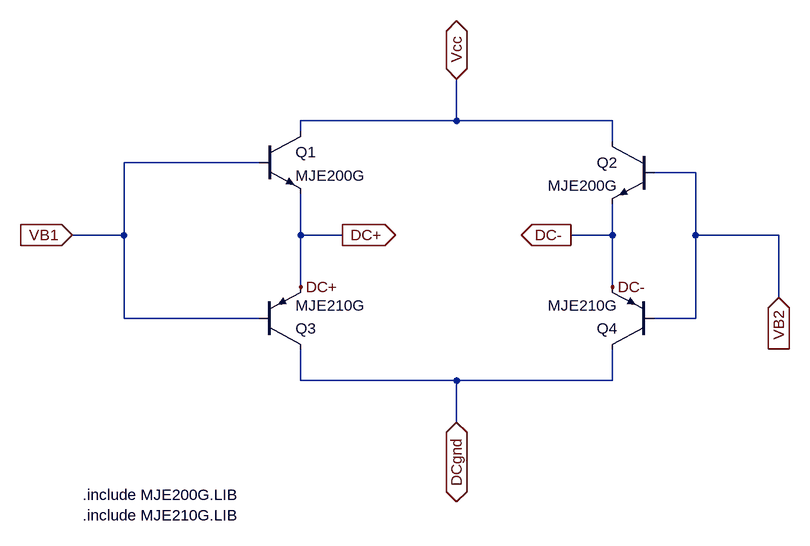
[diagram p0: schematic DC_Motor_Driver.asc]
DC_Motor_Driver.asc, the LTspice schematic file:
Version 4
SHEET 1 1376 684
WIRE 416 32 416 -32
WIRE 416 32 176 32
WIRE 656 32 416 32
WIRE 176 48 176 32
WIRE 656 64 656 32
WIRE 112 96 -96 96
WIRE 784 112 720 112
WIRE -96 208 -96 96
WIRE -96 208 -176 208
WIRE 176 208 176 144
WIRE 240 208 176 208
WIRE 656 208 656 160
WIRE 656 208 592 208
WIRE 784 208 784 112
WIRE 912 208 784 208
WIRE 176 288 176 208
WIRE 656 288 656 208
WIRE 912 304 912 208
WIRE -96 336 -96 208
WIRE 112 336 -96 336
WIRE 784 336 784 208
WIRE 784 336 720 336
WIRE 176 432 176 384
WIRE 416 432 176 432
WIRE 656 432 656 384
WIRE 656 432 416 432
WIRE 416 496 416 432
FLAG 912 304 VB2
IOPIN 912 304 In
FLAG 176 288 DC+
FLAG 656 288 DC-
FLAG -176 208 VB1
IOPIN -176 208 In
FLAG 416 -32 Vcc
IOPIN 416 -32 BiDir
FLAG 416 496 DCgnd
IOPIN 416 496 BiDir
FLAG 240 208 DC+
IOPIN 240 208 Out
FLAG 592 208 DC-
IOPIN 592 208 Out
SYMBOL npn 112 48 R0
SYMATTR InstName Q1
SYMATTR Value MJE200G
SYMBOL pnp 720 384 R180
SYMATTR InstName Q4
SYMATTR Value MJE210G
SYMBOL npn 720 64 M0
SYMATTR InstName Q2
SYMATTR Value MJE200G
SYMBOL pnp 112 384 M180
SYMATTR InstName Q3
SYMATTR Value MJE210G
TEXT -160 608 Left 2 !.include MJE200G.LIB\n.include MJE210G.LIB

The netlist it stands for:
* DC_Motor_Driver.asc
Q1 Vcc VB1 DC+ 0 MJE200G
Q4 DCgnd VB2 DC- 0 MJE210G
Q2 Vcc VB2 DC- 0 MJE200G
Q3 DCgnd VB1 DC+ 0 MJE210G
.model NPN NPN
.model PNP PNP
.lib standard.bjt
.include MJE200G.LIB
.include MJE210G.LIB
.backanno
.end